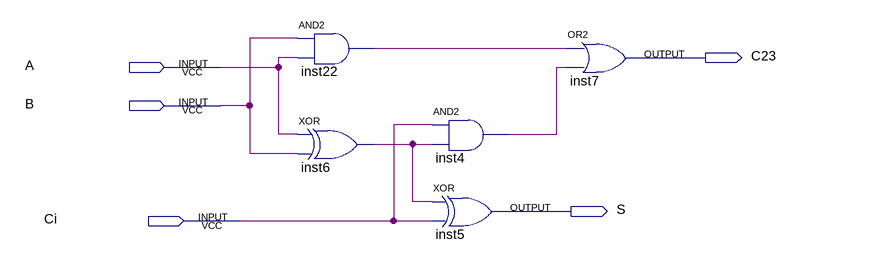
[diagram p0: schematic sheet]
// Quartus schematic Block2.bdf as structural Verilog: 5 symbols, 5 pins
module Block2 (
  input  A,
  input  B,
  input  Ci,
  output C23,
  output S
);

  wire inst4_out, inst6_out, inst22_out;

  and inst22 (inst22_out, B, A);
  xor inst6 (inst6_out, A, B);
  and inst4 (inst4_out, Ci, inst6_out);
  xor inst5 (S, inst6_out, Ci);
  or inst7 (C23, inst22_out, inst4_out);
endmodule
